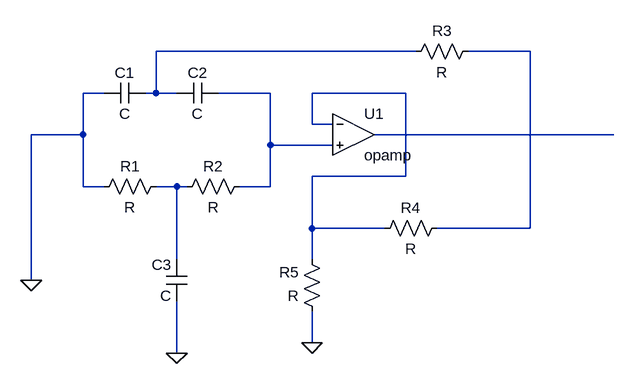
[diagram p0: schematic notch.asc]
notch.asc, the LTspice schematic file:
Version 4
SHEET 1 880 680
WIRE 448 32 48 32
WIRE 624 32 528 32
WIRE -32 96 -64 96
WIRE 48 96 48 32
WIRE 48 96 32 96
WIRE 80 96 48 96
WIRE 224 96 144 96
WIRE 432 96 288 96
WIRE 288 144 288 96
WIRE 320 144 288 144
WIRE -64 160 -64 96
WIRE -64 160 -144 160
WIRE 752 160 384 160
WIRE 224 176 224 96
WIRE 320 176 224 176
WIRE 432 224 432 96
WIRE 432 224 288 224
WIRE -64 240 -64 160
WIRE -32 240 -64 240
WIRE 80 240 48 240
WIRE 96 240 80 240
WIRE 224 240 224 176
WIRE 224 240 176 240
WIRE 288 304 288 224
WIRE 400 304 288 304
WIRE 624 304 624 32
WIRE 624 304 480 304
WIRE 80 352 80 240
WIRE 288 352 288 304
WIRE -144 384 -144 160
WIRE 288 480 288 432
WIRE 80 496 80 416
FLAG -144 384 0
FLAG 80 496 0
FLAG 288 480 0
SYMBOL cap 32 80 R90
WINDOW 0 0 32 VBottom 2
WINDOW 3 32 32 VTop 2
SYMATTR InstName C1
SYMBOL cap 144 80 R90
WINDOW 0 0 32 VBottom 2
WINDOW 3 32 32 VTop 2
SYMATTR InstName C2
SYMBOL res 64 224 R90
WINDOW 0 0 56 VBottom 2
WINDOW 3 32 56 VTop 2
SYMATTR InstName R1
SYMBOL res 192 224 R90
WINDOW 0 0 56 VBottom 2
WINDOW 3 32 56 VTop 2
SYMATTR InstName R2
SYMBOL res 544 16 R90
WINDOW 0 0 56 VBottom 2
WINDOW 3 32 56 VTop 2
SYMATTR InstName R3
SYMBOL res 496 288 R90
WINDOW 0 0 56 VBottom 2
WINDOW 3 32 56 VTop 2
SYMATTR InstName R4
SYMBOL res 304 448 R180
WINDOW 0 36 76 Left 2
WINDOW 3 36 40 Left 2
SYMATTR InstName R5
SYMBOL cap 96 416 R180
WINDOW 0 24 56 Left 2
WINDOW 3 24 8 Left 2
SYMATTR InstName C3
SYMBOL OpAmps\\opamp 352 96 R0
SYMATTR InstName U1

The netlist it stands for:
* notch.asc
C1 N001 0 C
C2 N003 N001 C
R1 N006 0 R
R2 N003 N006 R
R3 N002 N001 R
R4 N002 N004 R
R5 0 N004 R
C3 0 N006 C
XU1 N004 N003 N005 opamp Aol=100K GBW=10Meg  ; pins invin noninvin out
.backanno
.end